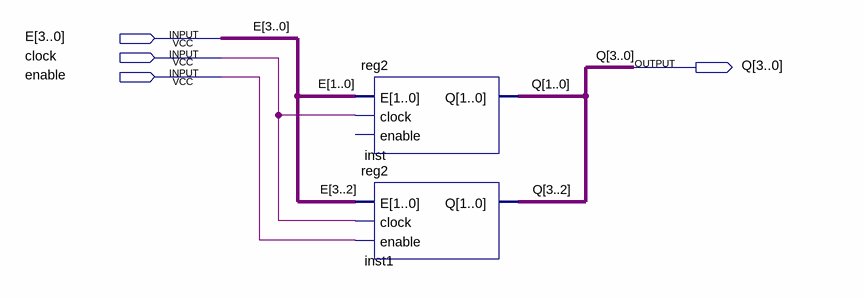
[diagram p0: schematic sheet]
// Quartus schematic reg4.bdf as structural Verilog: 2 symbols, 4 pins
module reg4 (
  input  [3:0] E,
  input  clock,
  input  enable,
  output [3:0] Q
);

  reg2 inst (.E(E[1:0]), .clock(clock), .Q(Q[1:0]));  // open: enable
  reg2 inst1 (.E(E[3:2]), .clock(clock), .enable(enable), .Q(Q[3:2]));
endmodule
